# Altium schematic sheet 1_Main.schdoc
size 497 x 243 mm; Name: A_A4; Symbol: A_A4; Device: A_A4; @Project Name: TUD-EnergyHarvestingConsole_2022-08-29_17-01-09; REV: 1.0; Date: 2022-08-11; Sheet: 1/1; Draw By: Alejandro Cabrerizo; Convert to PCB: yes; Add into BOM: yes
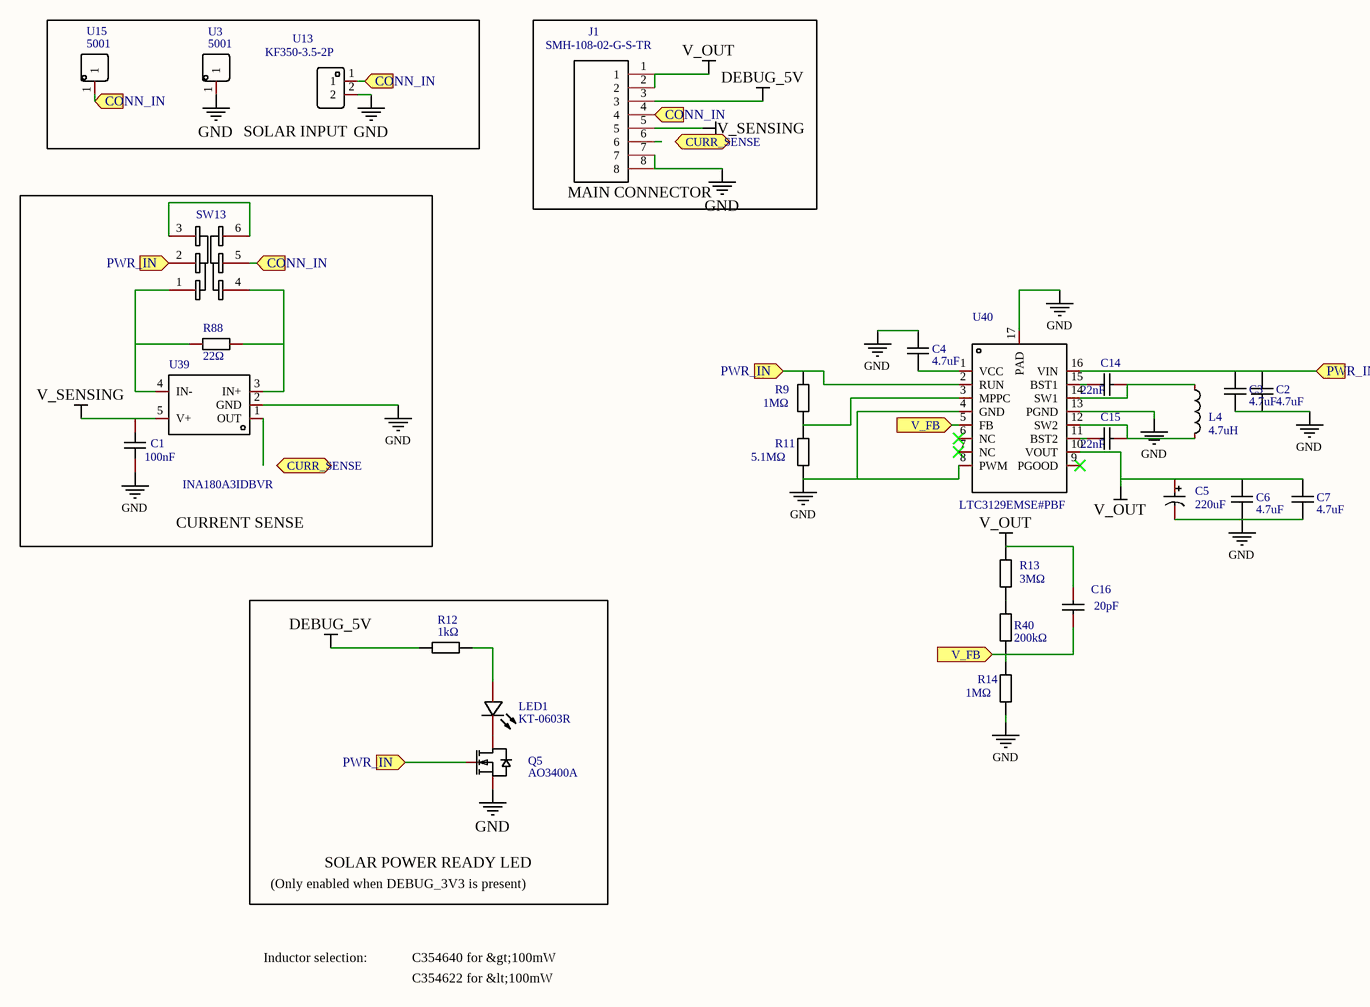
[diagram p0: 1_Main.schdoc]

## Parts
C1  100nF  [C0603]
C2  4.7uF  [C0603]
C3  4.7uF  [C0603]
C4  4.7uF  [C0603]
C5  220uF  [CAP-SMD_BD6.3-L6.6-W6.6-LS7.2-R-RD]
C6  4.7uF  [C0603]
C7  4.7uF  [C0603]
C14  value 22nF  [C0603]  (hidden comment: CL10B223KB8NNNC)
C15  value 22nF  [C0603]  (hidden comment: CL10B223KB8NNNC)
C16  value 20pF  [C0603]  (hidden comment: CL10C200JB8NNNC)
J1  SMH-108-02-G-S-TR  [SMH-108-02-XX-S-TR]
L4  value 4.7uH  [IND-SMD_L5.0-W5.0]  (hidden comment: SWPA5040S4R7NT)
LED1  KT-0603R  [LED0603-R-RD]
Q5  AO3400A  [SOT-23-3_L2.9-W1.6-P1.90-LS2.8-BR]
R9  1MΩ  [R0603]
R11  5.1MΩ  [R0603]
R12  1kΩ  [R0603]
R13  3MΩ  [R0603]
R14  1MΩ  [R0603]
R40  200kΩ  [R0603]
R88  value 22Ω  [R0603]  (hidden comment: 0603WAF220JT5E)
SW13  K3-2235D-F1  [SW-TH_K3-2235D-F1]  (value not drawn)
U3  5001  [TEST-TH_BD2.54-P1.39]
U13  KF350-3.5-2P  [CONN-TH_P3.50_KF350-3.5-2P]
U15  5001  [TEST-TH_BD2.54-P1.39]
U39  INA180A3IDBVR  [SOT-23-5_L3.0-W1.7-P0.95-LS2.8-BR]
U40  LCSC Part Name: LTC3129EMSE#PBF  [MSOP-16_L4.0-W3.0-P0.50-LS4.9-BL-EP]  (hidden comment: LTC3129EMSE-1#PBF)

## Blocks framed on the sheet
SOLAR INPUT: U3 U13 U15
MAIN CONNECTOR: J1
CURRENT SENSE: C1 R88 SW13 U39
SOLAR POWER READY LED: LED1 Q5 R12

## Ports
CONN_IN (in), CURR_SENSE (bidir), PWR_IN (in), V_FB (in)

## Nets
DEBUG_5V: J1.3 R12.1
GND: C1.1 C2.1 C3.1 C4.2 C5.2 C6.1 C7.1 J1.7 J1.8 Q5.2(S) R11.2 R14.1 U3.1 U13.2 U39.2(GND) U40.4(GND) U40.8(PWM) U40.13(PGND) U40.17(PAD)
V_OUT: C5.1 C6.2 C7.2 C16.2 J1.1 J1.2 R13.2 U40.10(VOUT)
V_SENSING: C1.2 J1.5 U39.5(V+)
CONN_IN: J1.4 SW13.5 U13.1 U15.1 ; port CONN_IN
PWR_IN: C2.2 C3.2 Q5.1(G) R9.2 SW13.2 U40.2(RUN) U40.16(VIN) ; port PWR_IN
V_FB: C16.1 R14.2 R40.2 U40.5(FB) ; port V_FB
NetC4_1: C4.1 U40.1(VCC)
NetC14_1: C14.1 U40.15(BST1)
NetC14_2: C14.2 L4.1 U40.14(SW1)
NetC15_1: C15.1 U40.11(BST2)
NetC15_2: C15.2 L4.2 U40.12(SW2)
NetLED1_1: LED1.1(A) R12.2
NetLED1_2: LED1.2(K) Q5.3(D)
NetR9_1: R9.1 R11.1 U40.3(MPPC)
NetR13_1: R13.1 R40.1
NetR88_1: R88.1 SW13.1 U39.4(IN-)
NetR88_2: R88.2 SW13.4 U39.3(IN+)
NetSW13_3: SW13.3 SW13.6

Not connected (* = marked no-connect by the designer): J1 6; U39 1(OUT); U40 6(NC)* 7(NC)* 9(PGOOD)*

## Notes on the sheet
- (Only enabled when DEBUG_3V3 is present)
- Inductor selection:
- C354622 for &lt;100mW
- C354640 for &gt;100mW
- 1
- 2
- 3
- 4
- 5
- A
- B
- C
- D
- TITLE:
- TUD-EnergyHarvestingConsole_2022-08-29_17-01-09
- REV:
- 1.0
- Date:
- Company:
- 2022-08-11
- Drawn By:
- Alejandro Cabrerizo
- Sheet:
- 1/1

## Library data of the parts
C1 = CC0603KRX7R9BB104: Manufacturer: YAGEO; Convert to PCB: yes; NAME: 2; Name: 100nF; Symbol: 100nF; Device: CC0603KRX7R9BB104; Supplier: LCSC; Manufacturer Part: CC0603KRX7R9BB104; Supplier Part: C14663; JLCPCB Part Class: Basic; Add into BOM: yes; Origin Footprint: C0603; NUMBER: 2
C2-C4 C6 C7 = CL10A475KO8NNNC: Manufacturer: SAMSUNG; Convert to PCB: yes; Name: 4.7uF; Symbol: 4.7uF; Device: CL10A475KO8NNNC; Supplier: LCSC; Manufacturer Part: CL10A475KO8NNNC; Supplier Part: C19666; JLCPCB Part Class: Basic Part; Add into BOM: yes; Origin Footprint: C0603
C5 = RVT1A221M0605: Manufacturer: HONOR; Convert to PCB: yes; Name: 220uF; Symbol: 220uF; Device: RVT1A221M0605; Supplier: LCSC; Manufacturer Part: RVT1A221M0605; Supplier Part: C3345; JLCPCB Part Class: Extended Part; Add into BOM: yes; Origin Footprint: CAP-SMD_BD6.3-L6.6-W6.6-LS7.2-R-RD
C14 C15 = CL10B223KB8NNNC: Capacitance: Tolerance:±10% Tolerance:±10% Voltage Rated: Temperature Coefficient:; Manufacturer: SAMSUNG(三星); Add into BOM: yes; Tolerance: ±10%; Symbol: CL10B223KB8NNNC; Device: CL10B223KB8NNNC; LCSC Part Name: 22nF ±10% 50V; Supplier Part: C21122; Manufacturer Part: CL10B223KB8NNNC; Supplier Footprint: 0603; JLCPCB Part Class: Basic Part; Datasheet: https://atta.szlcsc.com/upload/public/pdf/source/20160103/1457707705232.pdf; Supplier: LCSC; Convert to PCB: yes
C16 = CL10C200JB8NNNC: Capacitance: Tolerance:±5% Tolerance:±5% Voltage Rated: Temperature Coefficient:; Manufacturer: SAMSUNG(三星); Add into BOM: yes; Tolerance: ±5%; Symbol: CL10C200JB8NNNC; Device: CL10C200JB8NNNC; LCSC Part Name: 20pF ±5% 50V; Supplier Part: C1648; Manufacturer Part: CL10C200JB8NNNC; Supplier Footprint: 0603; JLCPCB Part Class: Basic Part; Datasheet: https://atta.szlcsc.com/upload/public/pdf/source/20160103/1457707686863.pdf; Supplier: LCSC; Convert to PCB: yes
J1 = SMH-108-02-G-S-TR: Convert to PCB: yes; Name: SMH-108-02-G-S-TR; Symbol: SMH-108-02-G-S-TR; Device: SMH-108-02-G-S-TR; Add into BOM: yes; Origin Footprint: SMH-108-02-XX-S-TR
L4 = SWPA5040S4R7NT: Inductance: Tolerance: Tolerance: Rated Current: Saturation Current (Isat):- DC Resistance (DCR):; Manufacturer: Sunlord(顺络); Add into BOM: yes; Symbol: SWPA5040S4R7NT; Device: SWPA5040S4R7NT; LCSC Part Name: 4.7uH ±30% 3A 30mΩ; Supplier Part: C305174; Manufacturer Part: SWPA5040S4R7NT; Supplier Footprint: SMD; JLCPCB Part Class: Extended Part; Datasheet: https://atta.szlcsc.com/upload/public/pdf/source/20210916/AC798BA7E846B7D0B6818F45CD84DB0B.pdf; Supplier: LCSC; Convert to PCB: yes; Saturation Current (Isat): -
LED1 = KT-0603R: Manufacturer: KENTO; Convert to PCB: yes; Name: KT-0603R; Symbol: KT-0603R; Device: KT-0603R; Supplier: LCSC; Manufacturer Part: KT-0603R; Supplier Part: C2286; JLCPCB Part Class: Basic Part; Add into BOM: yes; Origin Footprint: LED0603-R-RD
Q5 = AO3400A: Manufacturer: AOS; Convert to PCB: yes; Name: AO3400A; Symbol: AO3400A; Device: AO3400A; Supplier: LCSC; Manufacturer Part: AO3400A; Supplier Part: C20917; JLCPCB Part Class: Basic Part; Add into BOM: yes; Origin Footprint: SOT-23-3_L2.9-W1.6-P1.90-LS2.8-BR
R9 R14 = 0603WAF1004T5E: Manufacturer: UniOhm; Resistance: 1M; Convert to PCB: yes; Name: 1MΩ; Symbol: 1MΩ; Device: 0603WAF1004T5E; Supplier: LCSC; Manufacturer Part: 0603WAF1004T5E; Supplier Part: C22935; JLCPCB Part Class: Basic Part; Add into BOM: yes; Origin Footprint: R0603
R11 = 0603WAF5104T5E: Manufacturer: UniOhm; Resistance: 5.1M; Convert to PCB: yes; Name: 5.1MΩ; Symbol: 5.1MΩ; Device: 0603WAF5104T5E; Supplier: LCSC; Manufacturer Part: 0603WAF5104T5E; Supplier Part: C13320; JLCPCB Part Class: Basic Part; Add into BOM: yes; Origin Footprint: R0603
R12 = 0603WAF1001T5E: Manufacturer: UniOhm; Resistance: 1K; Convert to PCB: yes; Name: 1kΩ; Symbol: 1kΩ; Device: 0603WAF1001T5E; Supplier: LCSC; Manufacturer Part: 0603WAF1001T5E; Supplier Part: C21190; JLCPCB Part Class: Basic Part; Add into BOM: yes; Origin Footprint: R0603
R13 = 0603WAF3004T5E: Manufacturer: UniOhm; Resistance: 3M; Convert to PCB: yes; Name: 3MΩ; Symbol: 3MΩ; Device: 0603WAF3004T5E; Supplier: LCSC; Manufacturer Part: 0603WAF3004T5E; Supplier Part: C23156; JLCPCB Part Class: Basic Part; Add into BOM: yes; Origin Footprint: R0603
R40 = 0603WAF2003T5E: Manufacturer: UniOhm; Resistance: 200K; Convert to PCB: yes; Name: 200kΩ; Symbol: 200kΩ; Device: 0603WAF2003T5E; Supplier: LCSC; Manufacturer Part: 0603WAF2003T5E; Supplier Part: C25811; JLCPCB Part Class: Basic Part; Add into BOM: yes; Origin Footprint: R0603
R88 = 0603WAF220JT5E: Type:Thick Film Resistors Resistance: Tolerance:±1% Tolerance:±1% Power(Watts): Temperature Coefficient:±100ppm/ Temperature Coefficient:±100ppm/ Overload Voltage (Max): Operating Temperature Range:-55~+155 Operating Temperature Range:-55~+155; Manufacturer: UNI-ROYAL(厚声); Add into BOM: yes; Tolerance: ±1%; Symbol: 0603WAF220JT5E; Device: 0603WAF220JT5E; LCSC Part Name: 22Ω ±1% 100mW; Supplier Part: C23345; Manufacturer Part: 0603WAF220JT5E; Supplier Footprint: 0603; JLCPCB Part Class: Basic Part; Datasheet: https://atta.szlcsc.com/upload/public/pdf/source/20200306/C422600_1E6D84923E4A46A82E41ADD87F860B5C.pdf; Supplier: LCSC; Convert to PCB: yes; Type: Thick Film Resistors; Temperature Coefficient: ±100ppm/; Operating Temperature Range: -55~+155
SW13 = K3-2235D-F1: Current Rating (DC):300mA Voltage Rating (DC):6V Current Rating (AC):- Voltage Rating (AC):- Circuit:双刀双掷 Mounting Style:直插 Mechanical Life:10000 Actuator Color:黑色 Actuator Style:矩形柱状 Pin Style:PC引脚 Operating Temperature:-25~+80 Operating Temperature:-2; Manufacturer: 韩国韩荣; Add into BOM: yes; Current Rating (DC): 300mA; Voltage Rating (DC): 6V; Circuit: 双刀双掷; Mechanical Life: 10000; Actuator Color: 黑色; Actuator Style: 矩形柱状; Pin Style: PC引脚; Switch Length: 9mm; Switch Width: 3.5mm; Symbol: K3-2235D-F1; Device: K3-2235D-F1; LCSC Part Name: K3-2235D-F1; Supplier Part: C189615; Manufacturer Part: K3-2235D-F1; Supplier Footprint: 插件; JLCPCB Part Class: Extended Part; Datasheet: https://atta.szlcsc.com/upload/public/pdf/source/20210810/9F56F04DF7CBA8FC4D1B091DF1444945.pdf; Supplier: LCSC; Convert to PCB: yes; Current Rating (AC): -; Voltage Rating (AC): -; Mounting Style: 直插; Operating Temperature: -25~+80; Switch Height: 3.5mm
U3 U15 = 5001: Manufacturer: Keystone; Convert to PCB: yes; Name: 5001; Symbol: 5001; Device: 5001; Supplier: LCSC; Supplier Part: C238122; Manufacturer Part: 5001; JLCPCB Part Class: Extended Part; Add into BOM: yes; Origin Footprint: TEST-TH_BD2.54-P1.39
U13 = KF350-3.5-2P: Manufacturer: Cixi Kefa Elec; Convert to PCB: yes; Name: KF350-3.5-2P; Symbol: KF350-3.5-2P; Device: KF350-3.5-2P; Supplier: LCSC; Supplier Part: C474892; Manufacturer Part: KF350-3.5-2P; JLCPCB Part Class: Extended Part; Add into BOM: yes; Origin Footprint: CONN-TH_P3.50_KF350-3.5-2P
U39 = INA180A3IDBVR: Manufacturer: TI(德州仪器); Add into BOM: yes; Symbol: INA180A3IDBVR; Device: INA180A3IDBVR; LCSC Part Name: INA180A3IDBVR; Supplier Part: C122882; Manufacturer Part: INA180A3IDBVR; Supplier Footprint: SOT-23-5; JLCPCB Part Class: Extended Part; Datasheet: https://atta.szlcsc.com/upload/public/pdf/source/20171014/C122882_15079752744071037935.pdf; Supplier: LCSC; Convert to PCB: yes
U40 = LTC3129EMSE-1#PBF: Manufacturer: ADI(亚德诺)/LINEAR; Add into BOM: yes; Symbol: LTC3129EMSE-1#PBF; Device: LTC3129EMSE-1#PBF; Supplier Part: C684219; Manufacturer Part: LTC3129EMSE#PBF; Supplier Footprint: MSOP-16; JLCPCB Part Class: Extended Part; Datasheet: https://atta.szlcsc.com/upload/public/pdf/source/20170413/1492062818599.pdf; Supplier: LCSC; Convert to PCB: yes